# EAGLE design MAX485 BREAKOUT BOARD_v1 (EAGLE 7.6.0)
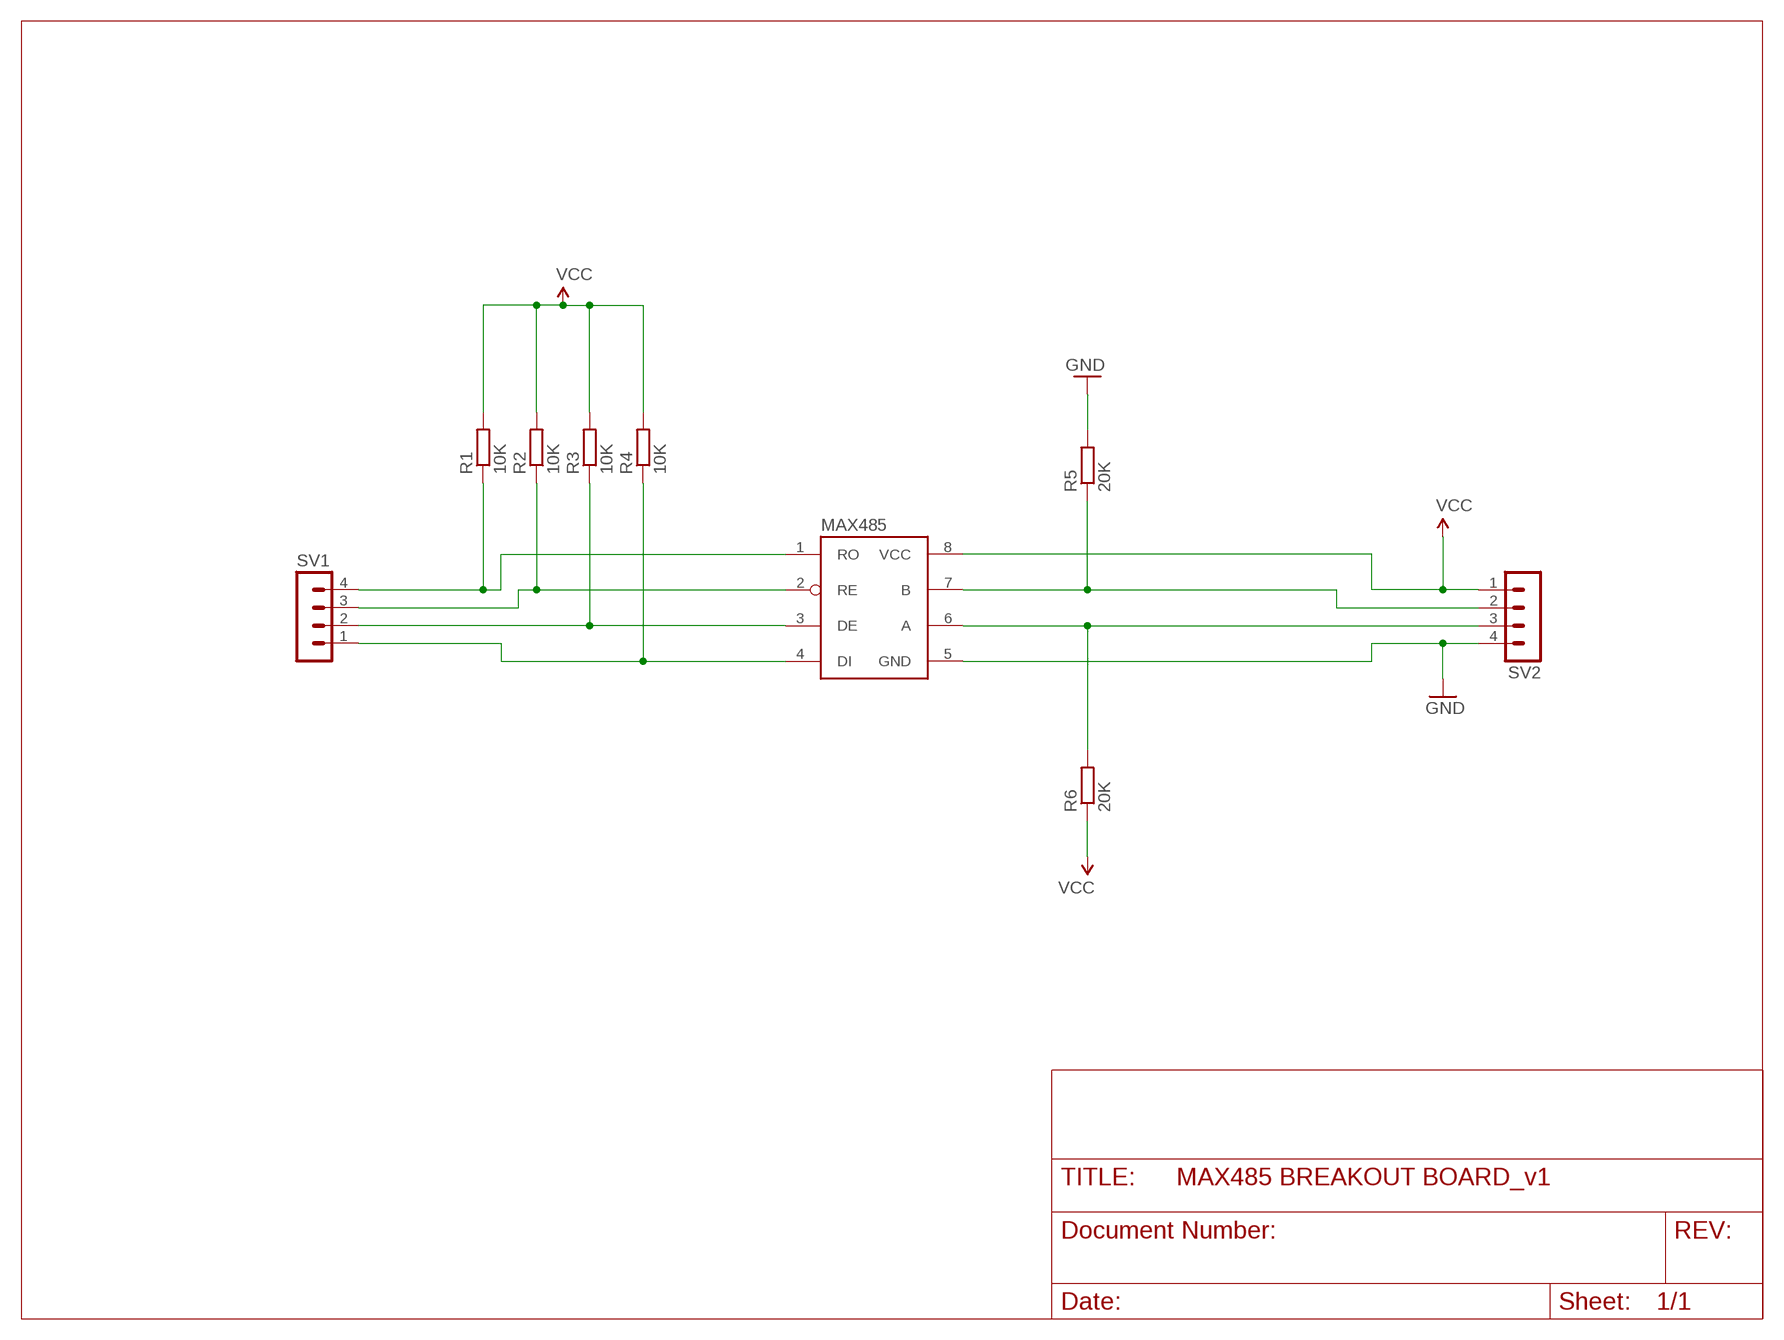
[diagram p0: schematic, sheet 1]

## Parts
MAX485  CINVESTAV_ADM1485  [CINVESTAV_SOIC8]
R1  10K  RCL_R-EU_R1206  [RCL_R1206]
R2  10K  RCL_R-EU_R1206  [RCL_R1206]
R3  10K  RCL_R-EU_R1206  [RCL_R1206]
R4  10K  RCL_R-EU_R1206  [RCL_R1206]
R5  20K  RCL_R-EU_R1206  [RCL_R1206]
R6  20K  RCL_R-EU_R1206  [RCL_R1206]
SV1  MA04-1  [MA04-1]
SV2  MA04-1  [MA04-1]

## Nets
GND: MAX485.5(GND) R5.2 SV2.4
N$1: MAX485.1(RO) R1.1 SV1.4
N$2: MAX485.2(RE) R2.1 SV1.3
N$3: MAX485.3(DE) R3.1 SV1.2
N$4: MAX485.4(DI) R4.1 SV1.1
N$5: MAX485.6(A) R6.2 SV2.3
N$7: MAX485.7(B) R5.1 SV2.2
VCC: MAX485.8(VCC) R1.2 R2.2 R3.2 R4.2 R6.1 SV2.1

## Library data of the parts
MAX485 = ijrobotics:CINVESTAV_ADM1485: ADM1485: Low power RS-1485 Transceiver
R1-R6 = ijrobotics:RCL_R-EU_: RESISTOR, European symbol
SV1 SV2 = con-lstb:MA04-1: PIN HEADER; OC_FARNELL: unknown; OC_NEWARK: unknown

## Board
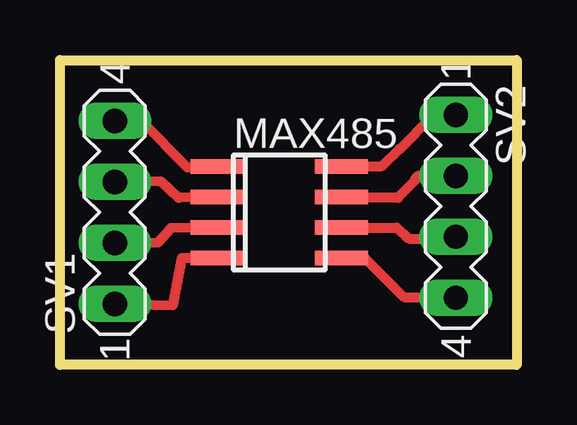
[diagram p1: board, top side]
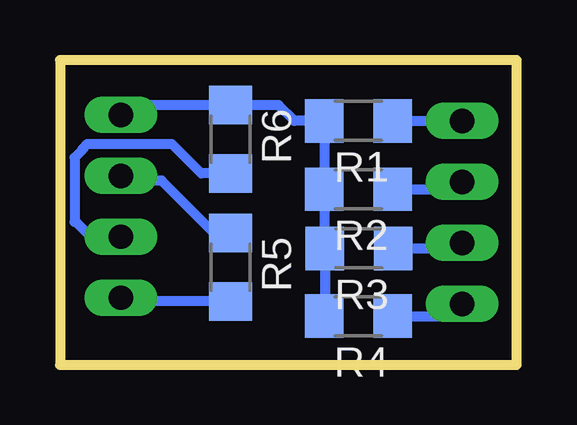
[diagram p2: board, bottom side, seen from below]

Size 19.05 x 12.7 mm. Coordinates in mm from the lower left corner, seen from the top.
Outline: 0,0 0,12.7 19.05,12.7 19.05,0 0,0
Copper layers (1*16): Top 0.035mm / dielectric 1.5mm / Bottom 0.035mm
Design rules "default": minimum track width 10mil, minimum drill 24mil, track to track 8mil, track to pad 8mil, pad to pad 8mil, via to via 8mil, smd to smd 8mil, copper to edge 40mil, drill to drill 8mil, minimum pad ring 10mil, minimum via ring 8mil, stop-mask expansion 4mil, vias tented up to drill 0mil, thermal gap 10mil

### Footprints (pad centres in the part's own frame; a part is rotated, then mirrored left to right if it is on the bottom)
CINVESTAV_SOIC8 = smd 0.6 x 2.2: 1 -1.905,-2.6; 2 -0.635,-2.6; 3 0.635,-2.6; 4 1.905,-2.6; 5 1.905,2.6; 6 0.635,2.6; 7 -0.635,2.6; 8 -1.905,2.6
RCL_R1206 = smd 1.6 x 1.803: 1 -1.422,0; 2 1.422,0
MA04-1 = drill 1.016 long: 1 -3.81,0; 2 -1.27,0; 3 1.27,0; 4 3.81,0

### Placement (x,y rotation side)
MAX485  9.14,6.35 270 top
R1  6.6,10.16 180 bottom
R2  6.6,7.32 180 bottom
R3  6.58,4.85 180 bottom
R4  6.6,2.03 180 bottom
R5  11.94,4.06 270 bottom
R6  11.94,9.4 270 bottom
SV1  2.29,6.35 90 top
SV2  16.51,6.6 270 top

### Tracks (layer width: path | path; a pad name or v marks a point on that pad's centre or on a via)
GND
  Top 0.406: MAX485.5 12.72,4.45 14.35,2.82 16.48,2.82 SV2.4
  Bottom 0.406: R5.2 16.36,2.64 SV2.4
N$1
  Top 0.406: SV1.4 2.31,10.19 3.38,10.16 5.31,8.23 MAX485.1
  Bottom 0.406: R1.1 SV1.4
N$2
  Top 0.406: MAX485.2 4.95,6.96 4.22,7.64 SV1.3
  Bottom 0.406: R2.1 2.59,7.32 SV1.3
N$3
  Top 0.406: MAX485.3 4.62,5.69 4.09,5.11 SV1.2
  Bottom 0.406: R3.1 2.52,4.85 SV1.2
N$4
  Top 0.406: SV1.1 4.7,2.49 5.08,4.45 MAX485.4
  Bottom 0.406: R4.1 2.79,2.03 SV1.1
N$5
  Top 0.406: MAX485.6 14.05,5.71 14.2,5.56 14.4,5.38 14.55,5.26 16.43,5.26 SV2.3
  Bottom 0.406: R6.2 13.16,7.98 14.38,9.2 17.91,9.2 18.11,8.99 18.11,8.97 18.44,8.64 18.44,5.94 18.36,5.94 17.7,5.28 16.56,5.28 SV2.3
N$7
  Top 0.406: SV2.2 14.94,7.87 14.81,7.75 14.81,7.67 14.1,6.96 11.77,6.96 MAX485.7
  Bottom 0.406: R5.1 12.62,5.49 14.81,7.67 16.31,7.67 SV2.2
VCC
  Top 0.406: MAX485.8 11.74,8.28 13.44,8.28 14.15,8.99 14.17,8.99 15.52,10.34 16.43,10.34 SV2.1
  Bottom 0.406: R6.1 16.1,10.82 SV2.1 | R6.1 9.93,10.82 9.27,10.16 R1.2 R2.2 8,7.29 R3.2 8,4.9 | R6.1 | 8,4.9 | 8,4.9 8,2.06 R4.2